# Altium project p253616.PrjPCB
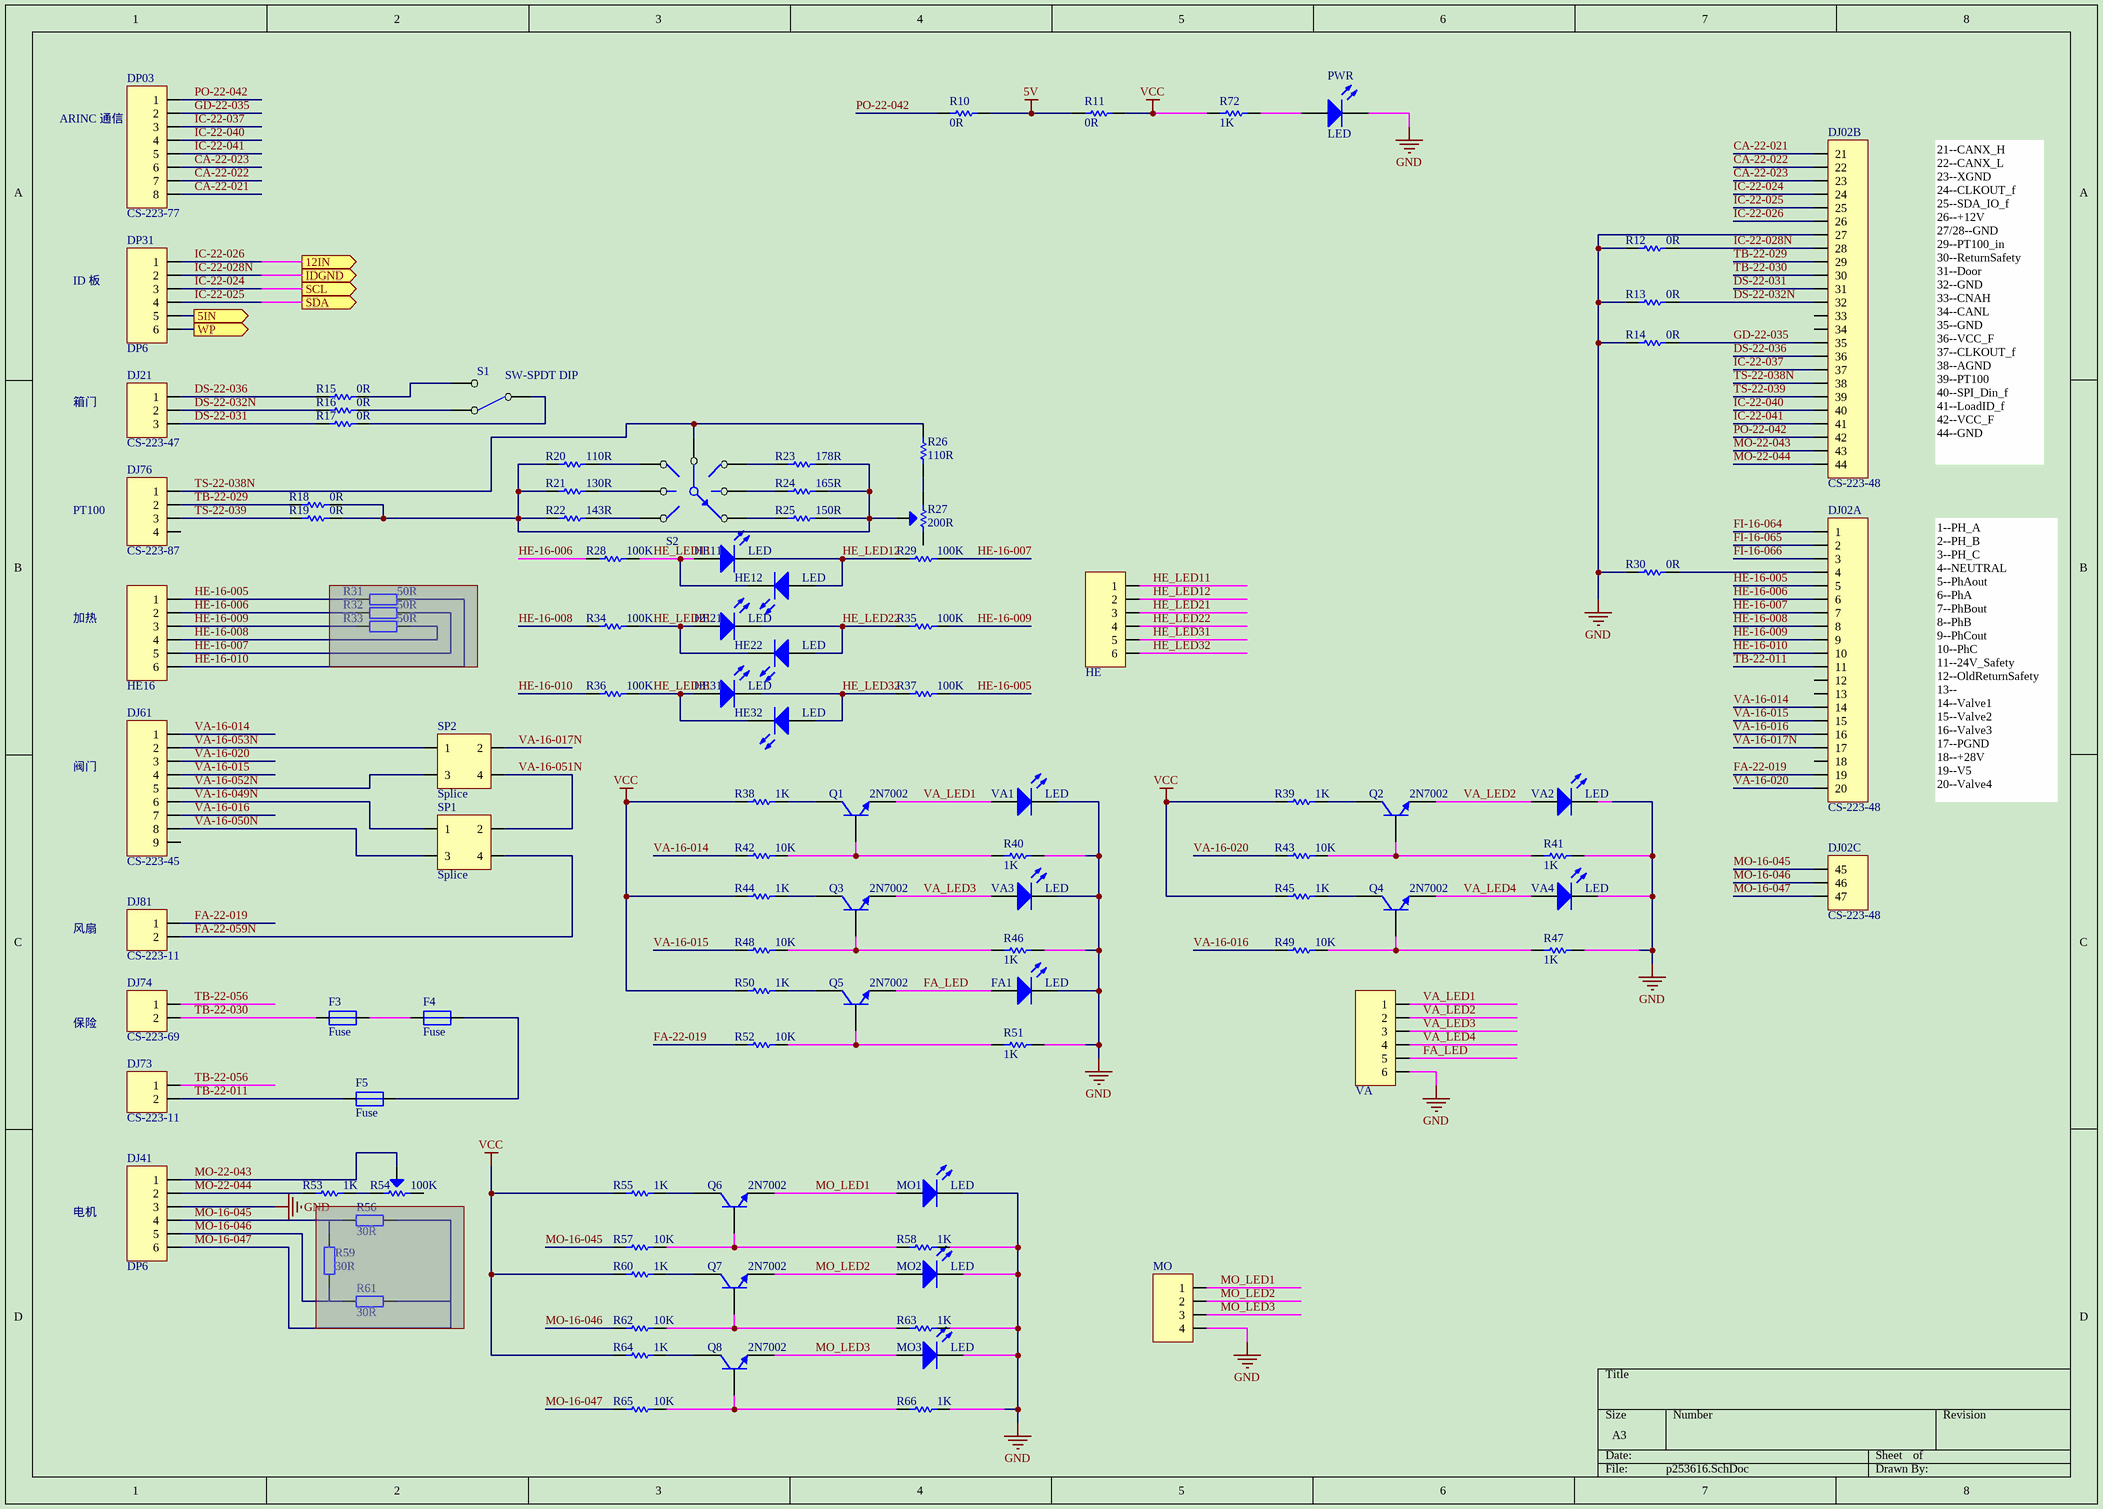
[diagram p0: p253616.SchDoc]
2 sheets, 140 parts. Net scope: flat (ports and power ports of the same name join across sheets).
Board file: p253616.PcbDoc
Sheets:
  p253616.SchDoc
  ID.SchDoc

## Sheet p253616.SchDoc
size A3

### Parts
DJ02  CS-223-48  [PCIH47M]  (parts A,B,C of 3)
DJ21  CS-223-47  [XH3_2.5mm]
DJ41  DP6  [KF301-6P_5mm]
DJ61  CS-223-45  [XH9_2.5mm]
DJ73  CS-223-11  [XH2_2.5mm]
DJ74  CS-223-69  [XH2_2.5mm]
DJ76  CS-223-87  [XH4_2.5mm]
DJ81  CS-223-11  [XH2_2.5mm]
DP03  CS-223-77  [XH8_2.5mm]
DP31  DP6  [XH6_2.5mm]
F3  Fuse  [Fuse]
F4  Fuse  [Fuse]
F5  Fuse  [Fuse]
FA1  LED  [LED 0805]
HE  DP6  [Pin6_2.54mm]  (value not drawn)
HE11  LED  [LED 0805]
HE12  LED  [LED 0805]
HE16  DP6  [KF301-6P_5mm]  (value not drawn)
HE21  LED  [LED 0805]
HE22  LED  [LED 0805]
HE31  LED  [LED 0805]
HE32  LED  [LED 0805]
MO  DP4  [Pin4_2.54mm]  (value not drawn)
MO1  LED  [LED 0805]
MO2  LED  [LED 0805]
MO3  LED  [LED 0805]
PWR  LED  [LED 0805]
Q1  2N7002  [SOT23_N]
Q2  2N7002  [SOT23_N]
Q3  2N7002  [SOT23_N]
Q4  2N7002  [SOT23_N]
Q5  2N7002  [SOT23_N]
Q6  2N7002  [SOT23_N]
Q7  2N7002  [SOT23_N]
Q8  2N7002  [SOT23_N]
R10  0R  [0603INCH_1608mm]
R11  0R  [0603INCH_1608mm]
R12  0R  [0603INCH_1608mm]
R13  0R  [0603INCH_1608mm]
R14  0R  [0603INCH_1608mm]
R15  0R  [0603INCH_1608mm]
R16  0R  [0603INCH_1608mm]
R17  0R  [0603INCH_1608mm]
R18  0R  [0603INCH_1608mm]
R19  0R  [0603INCH_1608mm]
R20  110R  [0603INCH_1608mm]
R21  130R  [0603INCH_1608mm]
R22  143R  [0603INCH_1608mm]
R23  178R  [0603INCH_1608mm]
R24  165R  [0603INCH_1608mm]
R25  150R  [0603INCH_1608mm]
R26  110R  [0603INCH_1608mm]
R27  200R  [3296W]
R28  100K  [0603INCH_1608mm]
R29  100K  [0603INCH_1608mm]
R30  0R  [0603INCH_1608mm]
R31  50R  [KF301-2P_5mm]  (masked out: inside a compile mask, not in the netlist)
R32  50R  [KF301-2P_5mm]  (masked out: inside a compile mask, not in the netlist)
R33  50R  [KF301-2P_5mm]  (masked out: inside a compile mask, not in the netlist)
R34  100K  [0603INCH_1608mm]
R35  100K  [0603INCH_1608mm]
R36  100K  [0603INCH_1608mm]
R37  100K  [0603INCH_1608mm]
R38  1K  [0603INCH_1608mm]
R39  1K  [0603INCH_1608mm]
R40  1K  [0603INCH_1608mm]
R41  1K  [0603INCH_1608mm]
R42  10K  [0603INCH_1608mm]
R43  10K  [0603INCH_1608mm]
R44  1K  [0603INCH_1608mm]
R45  1K  [0603INCH_1608mm]
R46  1K  [0603INCH_1608mm]
R47  1K  [0603INCH_1608mm]
R48  10K  [0603INCH_1608mm]
R49  10K  [0603INCH_1608mm]
R50  1K  [0603INCH_1608mm]
R51  1K  [0603INCH_1608mm]
R52  10K  [0603INCH_1608mm]
R53  1K  [0603INCH_1608mm]
R54  100K  [3296W]
R55  1K  [0603INCH_1608mm]
R56  30R  [KF301-2P_5mm]  (masked out: inside a compile mask, not in the netlist)
R57  10K  [0603INCH_1608mm]
R58  1K  [0603INCH_1608mm]
R59  30R  [KF301-2P_5mm]  (masked out: inside a compile mask, not in the netlist)
R60  1K  [0603INCH_1608mm]
R61  30R  [KF301-2P_5mm]  (masked out: inside a compile mask, not in the netlist)
R62  10K  [0603INCH_1608mm]
R63  1K  [0603INCH_1608mm]
R64  1K  [0603INCH_1608mm]
R65  10K  [0603INCH_1608mm]
R66  1K  [0603INCH_1608mm]
R72  1K  [0603INCH_1608mm]
S1  SW-SPDT DIP  [Pin3_2.54mm]
S2  SW-6WAY  [Pin7_2.54mm]  (value not drawn)
SP1  Splice  [SP4]
SP2  Splice  [SP4]
VA  DP6  [Pin6_2.54mm]  (value not drawn)
VA1  LED  [LED 0805]
VA2  LED  [LED 0805]
VA3  LED  [LED 0805]
VA4  LED  [LED 0805]

### Ports
5IN (out), 12IN (out), IDGND (out), SCL (out), SDA (out), WP (out)

### Nets
5V: R10.2 R11.1
GND: DJ02.27 DJ41.3 FA1.K MO.4 MO1.K MO2.K MO3.K PWR.K R12.1 R13.1 R14.1 R30.1 R40.2 R41.2 R46.2 R47.2 R51.2 R58.2 R63.2 R66.2 VA.6 VA1.K VA2.K VA3.K VA4.K
VCC: R11.2 R38.1 R39.1 R44.1 R45.1 R50.1 R55.1 R60.1 R64.1 R72.1
CA-22-021: DJ02.21 DP03.8
CA-22-022: DJ02.22 DP03.7
CA-22-023: DJ02.23 DP03.6
DS-22-031: DJ02.31 DJ21.3 R17.1
DS-22-032N: DJ02.32 DJ21.2 R13.2 R16.1
DS-22-036: DJ02.36 DJ21.1 R15.1
FA-22-019: DJ02.19 DJ81.1 R52.2
FA-22-059N: DJ81.2 SP1.4
FA_LED: FA1.A Q5.1(E) VA.5
FI-16-064: DJ02.1
FI-16-065: DJ02.2
FI-16-066: DJ02.3
GD-22-035: DJ02.35 DP03.2 R14.2
HE-16-005: DJ02.5 HE16.1 R37.2
HE-16-006: DJ02.6 HE16.2 R28.1
HE-16-007: DJ02.7 HE16.5 R29.2
HE-16-008: DJ02.8 HE16.4 R34.1
HE-16-009: DJ02.9 HE16.3 R35.2
HE-16-010: DJ02.10 HE16.6 R36.1
HE_LED11: HE.1 HE11.A HE12.K R28.2
HE_LED12: HE.2 HE11.K HE12.A R29.1
HE_LED21: HE.3 HE21.A HE22.K R34.2
HE_LED22: HE.4 HE21.K HE22.A R35.1
HE_LED31: HE.5 HE31.A HE32.K R36.2
HE_LED32: HE.6 HE31.K HE32.A R37.1
IC-22-024: DJ02.24 DP31.3 ; port SCL
IC-22-025: DJ02.25 DP31.4 ; port SDA
IC-22-026: DJ02.26 DP31.1 ; port 12IN
IC-22-028N: DJ02.28 DP31.2 R12.2 ; port IDGND
IC-22-037: DJ02.37 DP03.3
IC-22-040: DJ02.40 DP03.4
IC-22-041: DJ02.41 DP03.5
MO-16-045: DJ02.45 DJ41.4 R57.1
MO-16-046: DJ02.46 DJ41.5 R62.1
MO-16-047: DJ02.47 DJ41.6 R65.1
MO-22-043: DJ02.43 DJ41.1 R54.2
MO-22-044: DJ02.44 DJ41.2 R53.1
MO_LED1: MO.1 MO1.A Q6.1(E)
MO_LED2: MO.2 MO2.A Q7.1(E)
MO_LED3: MO.3 MO3.A Q8.1(E)
PO-22-042: DJ02.42 DP03.1 R10.1
TB-22-011: DJ02.11 DJ73.2 F5.1
TB-22-029: DJ02.29 DJ76.2 R18.1
TB-22-030: DJ02.30 DJ74.2 F3.1
TB-22-056: DJ73.1 DJ74.1
TS-22-038N: DJ02.38 DJ76.1 R26.2 S2.7
TS-22-039: DJ02.39 DJ76.3 R19.1
VA-16-014: DJ02.14 DJ61.1 R42.1
VA-16-015: DJ02.15 DJ61.4 R48.1
VA-16-016: DJ02.16 DJ61.7 R49.1
VA-16-017N: DJ02.17 SP2.2
VA-16-020: DJ02.20 DJ61.3 R43.1
VA-16-049N: DJ61.6 SP1.1
VA-16-050N: DJ61.8 SP1.3
VA-16-051N: SP1.2 SP2.4
VA-16-052N: DJ61.5 SP2.3
VA-16-053N: DJ61.2 SP2.1
VA_LED1: Q1.1(E) VA.1 VA1.A
VA_LED2: Q2.1(E) VA.2 VA2.A
VA_LED3: Q3.1(E) VA.3 VA3.A
VA_LED4: Q4.1(E) VA.4 VA4.A
NetDJ02_4: DJ02.4 R30.2
NetDP31_5: DP31.5 ; port 5IN
NetDP31_6: DP31.6 ; port WP
NetF3_2: F3.2 F4.1
NetF4_2: F4.2 F5.2
NetPWR_A: PWR.A R72.2
NetQ1_2: Q1.2(B) R40.1 R42.2
NetQ1_3: Q1.3(C) R38.2
NetQ2_2: Q2.2(B) R41.1 R43.2
NetQ2_3: Q2.3(C) R39.2
NetQ3_2: Q3.2(B) R46.1 R48.2
NetQ3_3: Q3.3(C) R44.2
NetQ4_2: Q4.2(B) R47.1 R49.2
NetQ4_3: Q4.3(C) R45.2
NetQ5_2: Q5.2(B) R51.1 R52.1
NetQ5_3: Q5.3(C) R50.2
NetQ6_2: Q6.2(B) R57.2 R58.1
NetQ6_3: Q6.3(C) R55.2
NetQ7_2: Q7.2(B) R62.2 R63.1
NetQ7_3: Q7.3(C) R60.2
NetQ8_2: Q8.2(B) R65.2 R66.1
NetQ8_3: Q8.3(C) R64.2
NetR15_2: R15.2 S1.3(NO)
NetR16_2: R16.2 S1.2(NC)
NetR17_2: R17.2 S1.1(COMMON)
NetR18_2: R18.2 R19.2 R20.2 R21.1 R22.1 R23.2 R24.2 R25.2 R27.2
NetR20_1: R20.1 S2.1
NetR21_2: R21.2 S2.2
NetR22_2: R22.2 S2.3
NetR23_1: R23.1 S2.4
NetR24_1: R24.1 S2.5
NetR25_1: R25.1 S2.6
NetR26_1: R26.1 R27.3
NetR53_2: R53.2 R54.1

Not connected (* = marked no-connect by the designer): DJ02 12 13 18 33 34; DJ61 9; DJ76 4; R27 1; R54 3

### Notes on the sheet
- ARINC 通信
- ID 板
- 箱门
- PT100
- 21--CANX_H
  22--CANX_L
  23--XGND
  24--CLKOUT_f
  25--SDA_IO_f
  26--+12V
  27/28--GND
  29--PT100_in
  30--ReturnSafety
  31--Door
  32--GND
  33--CNAH
  34--CANL
  35--GND
  36--VCC_F
  37--CLKOUT_f
  38--AGND
  39--PT100
  40--SPI_Din_f
  41--LoadID_f
  42--VCC_F
  44--GND
- 加热
- 阀门
- 1--PH_A
  2--PH_B
  3--PH_C
  4--NEUTRAL
  5--PhAout
  6--PhA
  7--PhBout
  8--PhB
  9--PhCout
  10--PhC
  11--24V_Safety
  12--OldReturnSafety
  13--
  14--Valve1
  15--Valve2
  16--Valve3
  17--PGND
  18--+28V
  19--V5
  20--Valve4
- 风扇
- 保险
- 电机

### Library data of the parts
DJ02 = PCIH47
DJ21 = DP3
DJ61 = DP9
DJ73 DJ74 DJ81 = DP2
DJ76 = DP4
DP03 = DP8
Q1-Q8 = NPN
R10-R26 R28-R30 R34-R37 R42 R43 R48 R49 R52 R57 R62 R65 = Res: Value: 1K
R27 R54 = RPot
R31-R33 R56 R59 R61 = Res2
R38-R41 R44-R47 R50 R51 R53 R55 R58 R60 R63 R64 R66 R72 = Res: Value: 1K

## Sheet ID.SchDoc
size A4
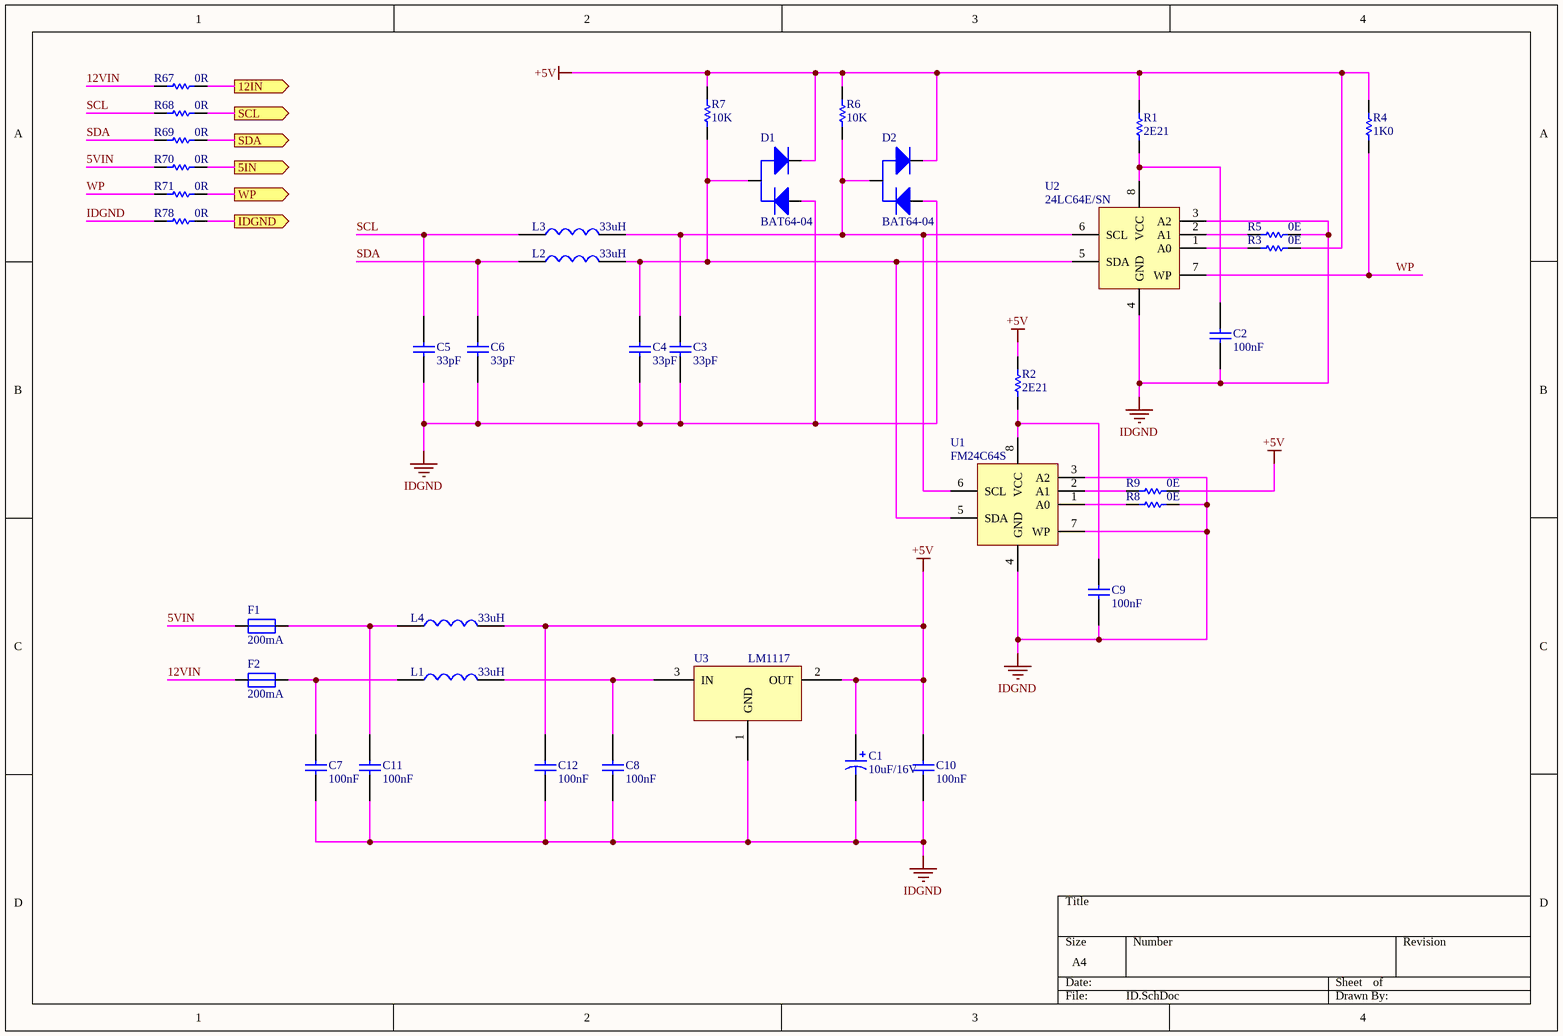
[diagram p1: ID.SchDoc]

### Parts
C1  10uF/16V  [7343-CAP]
C2  100nF  [0603INCH_1608mm]
C3  33pF  [0603INCH_1608mm]
C4  33pF  [0603INCH_1608mm]
C5  33pF  [0603INCH_1608mm]
C6  33pF  [0603INCH_1608mm]
C7  100nF  [0603INCH_1608mm]
C8  100nF  [0603INCH_1608mm]
C9  100nF  [0603INCH_1608mm]
C10  100nF  [0603INCH_1608mm]
C11  100nF  [0603INCH_1608mm]
C12  100nF  [0603INCH_1608mm]
D1  BAT64-04  [SOT23_N]
D2  BAT64-04  [SOT23_N]
F1  200mA  [Fuse]
F2  200mA  [Fuse]
L1  33uH  [3216 Chip]
L2  33uH  [3216 Chip]
L3  33uH  [3216 Chip]
L4  33uH  [3216 Chip]
R1  2E21  [0603INCH_1608mm]
R2  2E21  [0603INCH_1608mm]
R3  0E  [0603INCH_1608mm]
R4  1K0  [0603INCH_1608mm]
R5  0E  [0603INCH_1608mm]
R6  10K  [0603INCH_1608mm]
R7  10K  [0603INCH_1608mm]
R8  0E  [0603INCH_1608mm]
R9  0E  [0603INCH_1608mm]
R67  0R  [0603INCH_1608mm]
R68  0R  [0603INCH_1608mm]
R69  0R  [0603INCH_1608mm]
R70  0R  [0603INCH_1608mm]
R71  0R  [0603INCH_1608mm]
R78  0R  [0603INCH_1608mm]
U1  FM24C64S  [SOIC127P600-8M]
U2  24LC64E/SN  [SOIC127P600-8M]
U3  LM1117  [SOT223]

### Ports
5IN (out), 12IN (out), IDGND (out), SCL (out), SDA (out), WP (out)

### Nets
+5V: C1.1 C10.2 C12.2 D1.2 D2.2 L4.2 R1.2 R2.2 R3.2 R4.2 R6.2 R7.2 R9.2 U3.2(OUT)
IDGND: C1.2 C2.1 C3.1 C4.1 C5.1 C6.1 C7.1 C8.1 C9.1 C10.1 C11.1 C12.1 D1.1 D2.1 R5.2 R8.2 R78.1 U1.3(A2) U1.4(GND) U1.7(WP) U2.3(A2) U2.4(GND) U3.1(GND)
5VIN: F1.1 R70.1
12VIN: F2.1 R67.1
IC-22-024: R68.2 ; port SCL
IC-22-025: R69.2 ; port SDA
IC-22-026: R67.2 ; port 12IN
IC-22-028N: R78.2 ; port IDGND
SCL: C5.2 L3.1 R68.1
SDA: C6.2 L2.1 R69.1
WP: R4.1 R71.1 U2.7(WP)
NetC2_2: C2.2 R1.1 U2.8(VCC)
NetC3_2: C3.2 D2.3 L3.2 R6.1 U1.6(SCL) U2.6(SCL)
NetC4_2: C4.2 D1.3 L2.2 R7.1 U1.5(SDA) U2.5(SDA)
NetC7_2: C7.2 F2.2 L1.1
NetC8_2: C8.2 L1.2 U3.3(IN)
NetC9_2: C9.2 R2.1 U1.8(VCC)
NetC11_2: C11.2 F1.2 L4.1
NetDP31_5: R70.2 ; port 5IN
NetDP31_6: R71.2 ; port WP
NetR3_1: R3.1 U2.1(A0)
NetR5_1: R5.1 U2.2(A1)
NetR8_1: R8.1 U1.1(A0)
NetR9_1: R9.1 U1.2(A1)

Not connected (* = marked no-connect by the designer): U3 4

### Library data of the parts
C1 = Cap_Pol: Value: 100pF
C2-C12 = Cap: Value: 100pF
F1 F2 = Fuse
L1-L4 = Inductor
R1-R9 R67-R71 R78 = Res: Value: 1K
U1 U2 = IIC Mem
U3 = 7805

## Nets that join several sheets
IC-22-024: p253616 (DJ02.24 DP31.3), ID (R68.2)
IC-22-025: p253616 (DJ02.25 DP31.4), ID (R69.2)
IC-22-026: p253616 (DJ02.26 DP31.1), ID (R67.2)
IC-22-028N: p253616 (DJ02.28 DP31.2 R12.2), ID (R78.2)
NetDP31_5: p253616 (DP31.5), ID (R70.2)
NetDP31_6: p253616 (DP31.6), ID (R71.2)